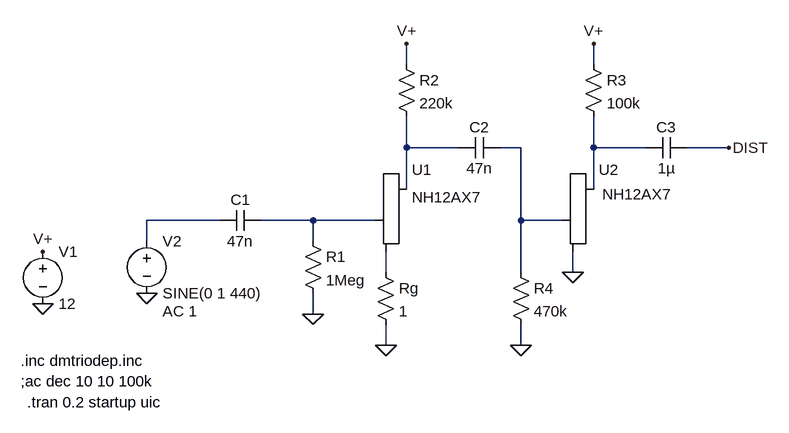
[diagram p0: schematic valve_dist.asc]
valve_dist.asc, the LTspice schematic file:
Version 4
SHEET 1 916 680
WIRE 192 -96 192 -128
WIRE 480 -96 480 -128
WIRE 192 32 192 -16
WIRE 272 32 192 32
WIRE 368 32 336 32
WIRE 480 32 480 -16
WIRE 560 32 480 32
WIRE 688 32 624 32
WIRE 192 96 192 32
WIRE 480 96 480 32
WIRE -96 144 -208 144
WIRE 48 144 -32 144
WIRE 144 144 48 144
WIRE 368 144 368 32
WIRE 432 144 368 144
WIRE -208 176 -208 144
WIRE 48 176 48 144
WIRE 160 224 160 192
WIRE 368 224 368 144
WIRE 448 224 448 192
WIRE 48 288 48 256
WIRE 160 336 160 304
WIRE 368 336 368 304
FLAG -368 272 0
FLAG -368 192 V+
FLAG 160 336 0
FLAG -208 256 0
FLAG 48 288 0
FLAG 192 -128 V+
FLAG 368 336 0
FLAG 448 224 0
FLAG 480 -128 V+
FLAG 688 32 DIST
SYMBOL Misc\\triode 192 144 R0
WINDOW 3 -24 64 Invisible 2
WINDOW 38 8 -36 Left 2
SYMATTR InstName U1
SYMATTR Value ""
SYMATTR SpiceModel NH12AX7
SYMBOL voltage -368 176 R0
SYMATTR InstName V1
SYMATTR Value 12
SYMBOL res 144 208 R0
SYMATTR InstName Rg
SYMATTR Value 1
SYMBOL cap -32 128 R90
WINDOW 0 0 32 VBottom 2
WINDOW 3 32 32 VTop 2
SYMATTR InstName C1
SYMATTR Value 47n
SYMBOL voltage -208 160 R0
WINDOW 123 24 124 Left 2
WINDOW 39 0 0 Left 0
SYMATTR InstName V2
SYMATTR Value SINE(0 1 440)
SYMATTR Value2 AC 1
SYMBOL res 32 160 R0
SYMATTR InstName R1
SYMATTR Value 1Meg
SYMBOL res 176 -112 R0
SYMATTR InstName R2
SYMATTR Value 220k
SYMBOL cap 336 16 R90
WINDOW 0 0 32 VBottom 2
WINDOW 3 32 32 VTop 2
SYMATTR InstName C2
SYMATTR Value 47n
SYMBOL Misc\\triode 480 144 R0
WINDOW 3 -24 64 Invisible 2
WINDOW 38 13 -40 Left 2
SYMATTR InstName U2
SYMATTR Value ""
SYMATTR SpiceModel NH12AX7
SYMBOL res 352 208 R0
SYMATTR InstName R4
SYMATTR Value 470k
SYMBOL res 464 -112 R0
SYMATTR InstName R3
SYMATTR Value 100k
SYMBOL cap 624 16 R90
WINDOW 0 0 32 VBottom 2
WINDOW 3 32 32 VTop 2
SYMATTR InstName C3
SYMATTR Value 1µ
TEXT -402 360 Left 2 !.inc dmtriodep.inc\n;ac dec 10 10 100k
TEXT -392 424 Left 2 !.tran 0.2 startup uic

The netlist it stands for:
* valve_dist.asc
XU1 N001 N005 N006 NH12AX7
V1 V+ 0 12
Rg N006 0 1
C1 N005 N004 47n
V2 N004 0 SINE(0 1 440) AC 1
R1 N005 0 1Meg
R2 V+ N001 220k
C2 N002 N001 47n
XU2 N003 N002 0 NH12AX7
R4 N002 0 470k
R3 V+ N003 100k
C3 DIST N003 1µ
.inc dmtriodep.inc
;ac dec 10 10 100k
.tran 0.2 startup uic
.backanno
.end